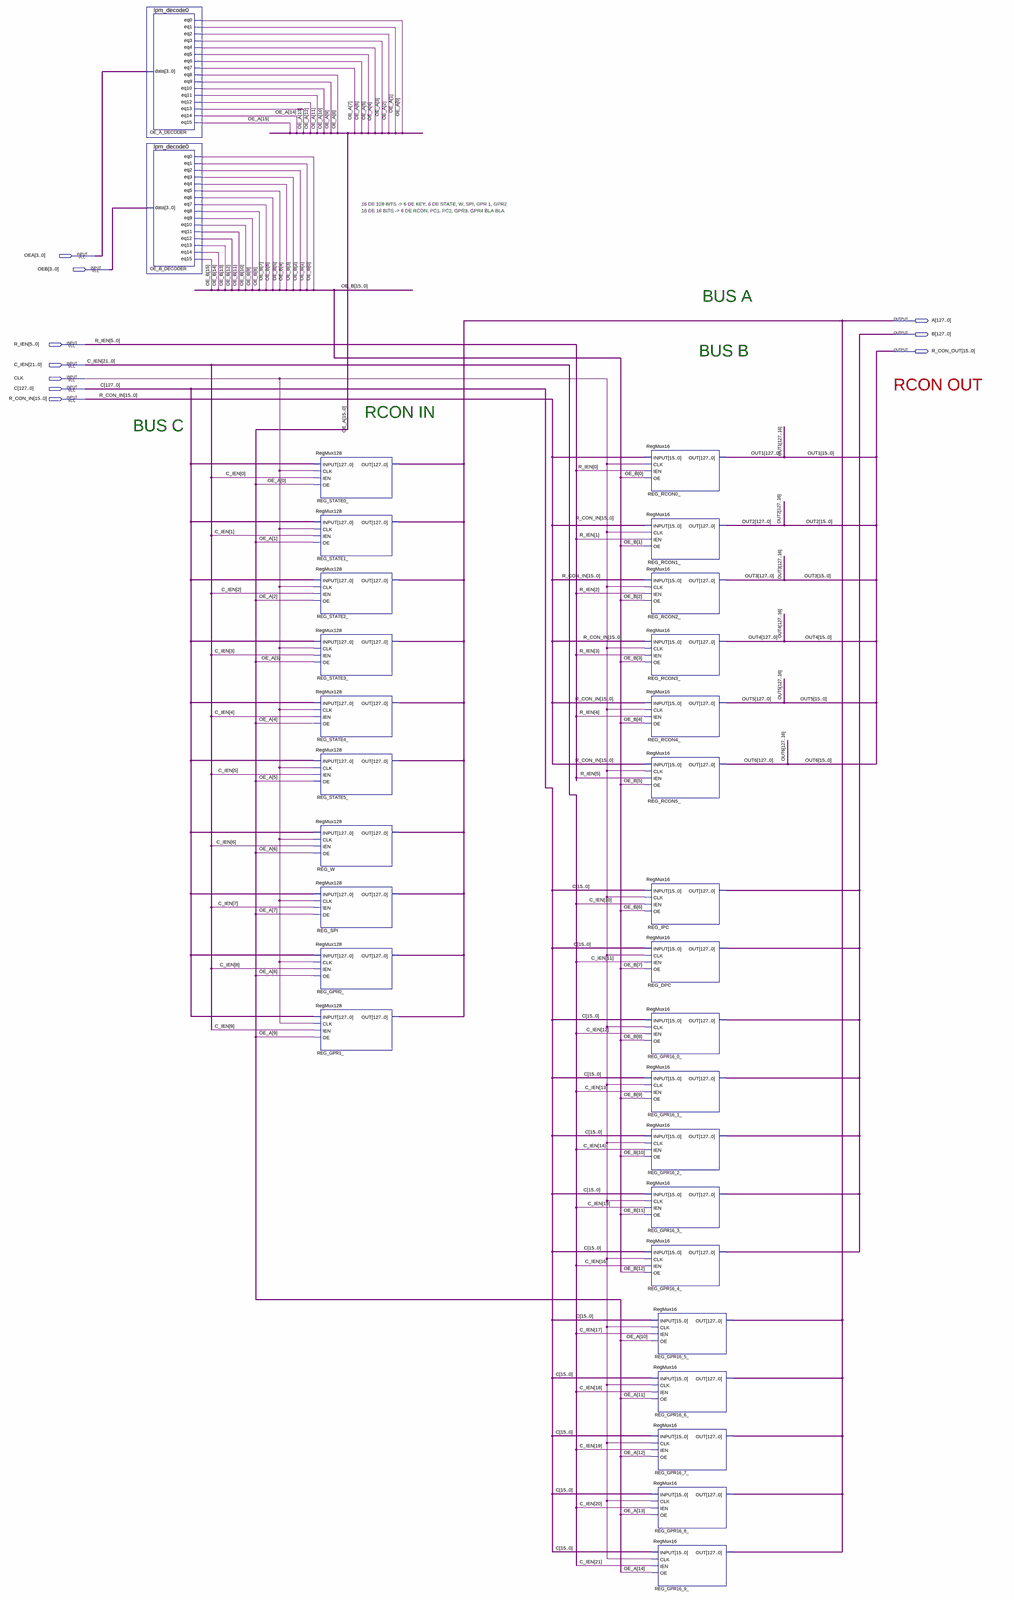
[diagram p0: schematic sheet, whole]
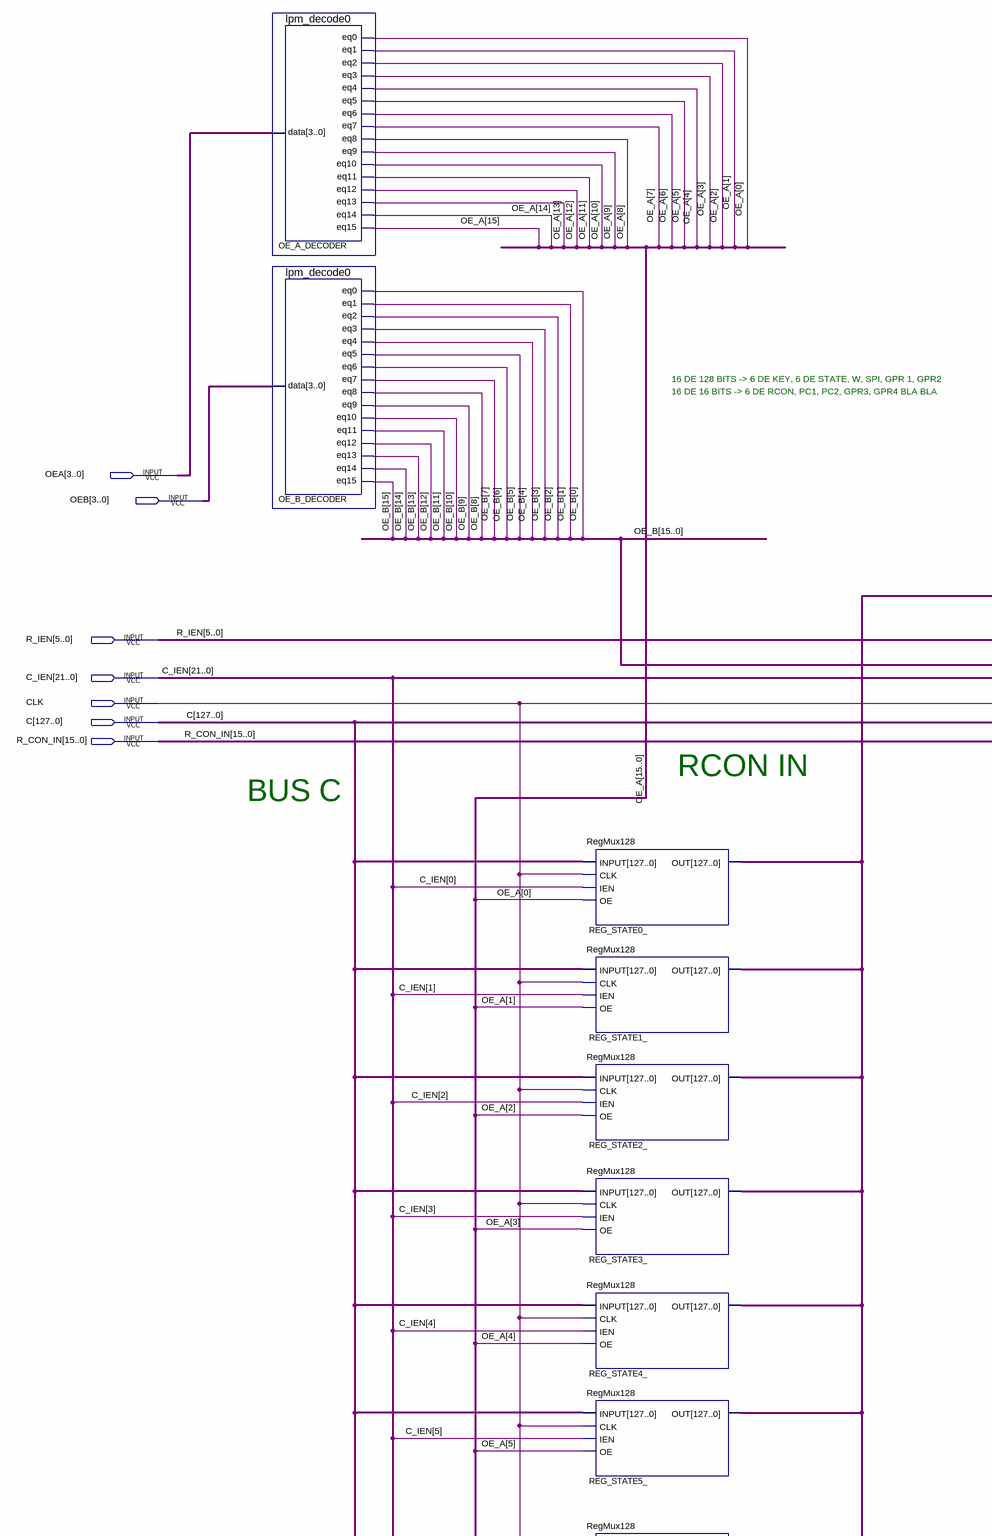
[diagram p1: schematic sheet, upper left part]
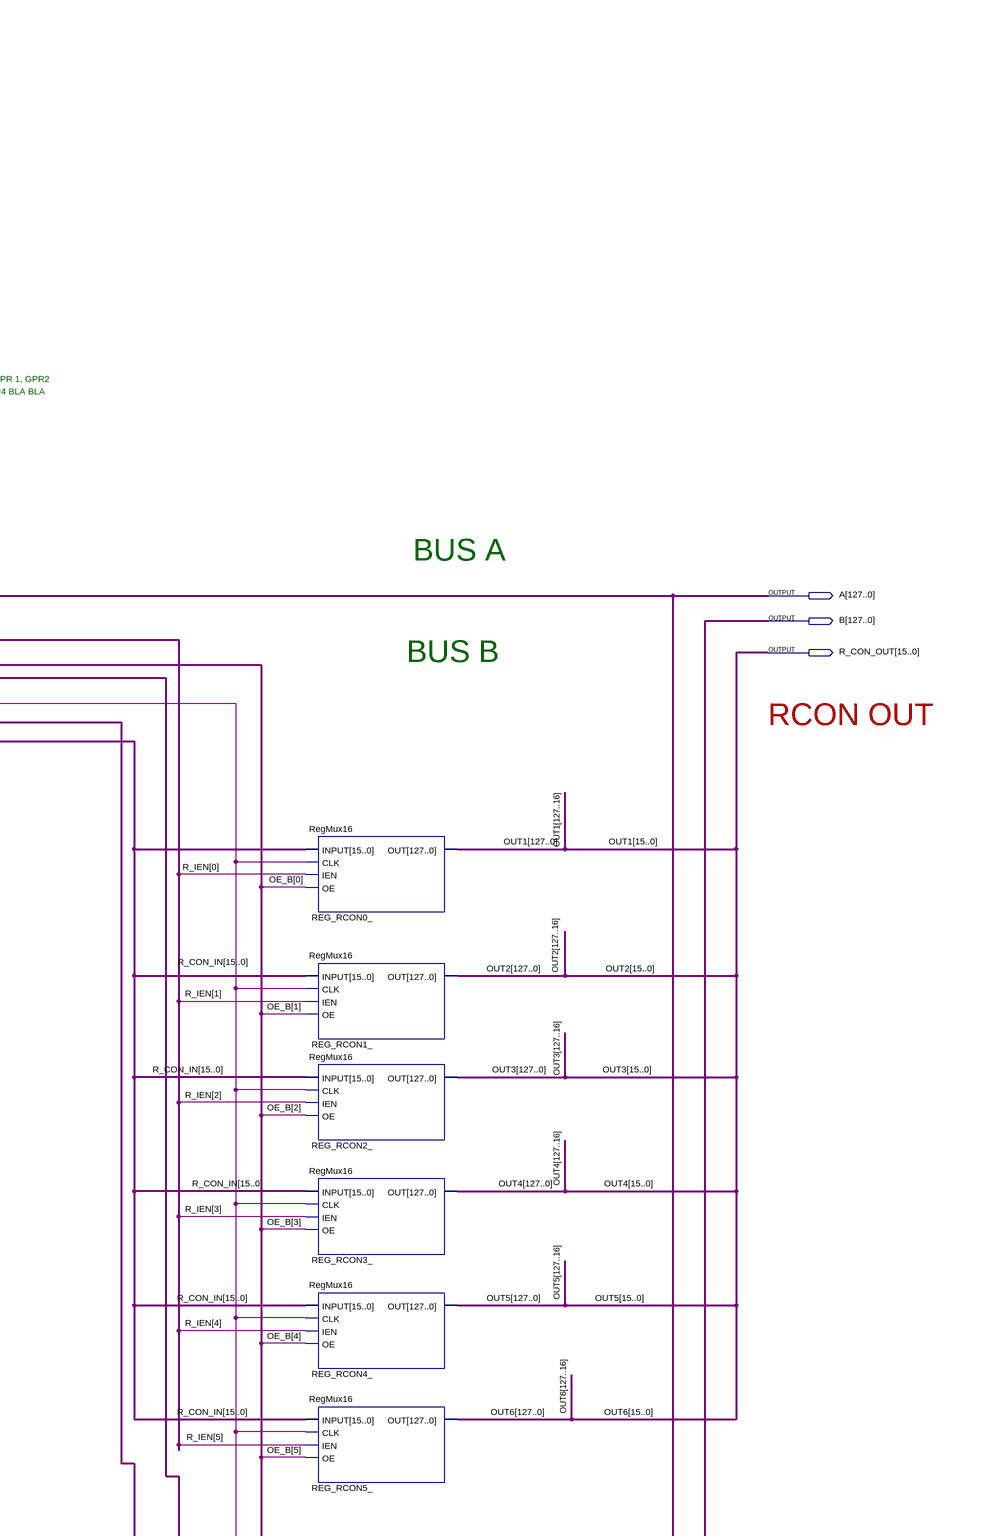
[diagram p2: schematic sheet, upper right part]
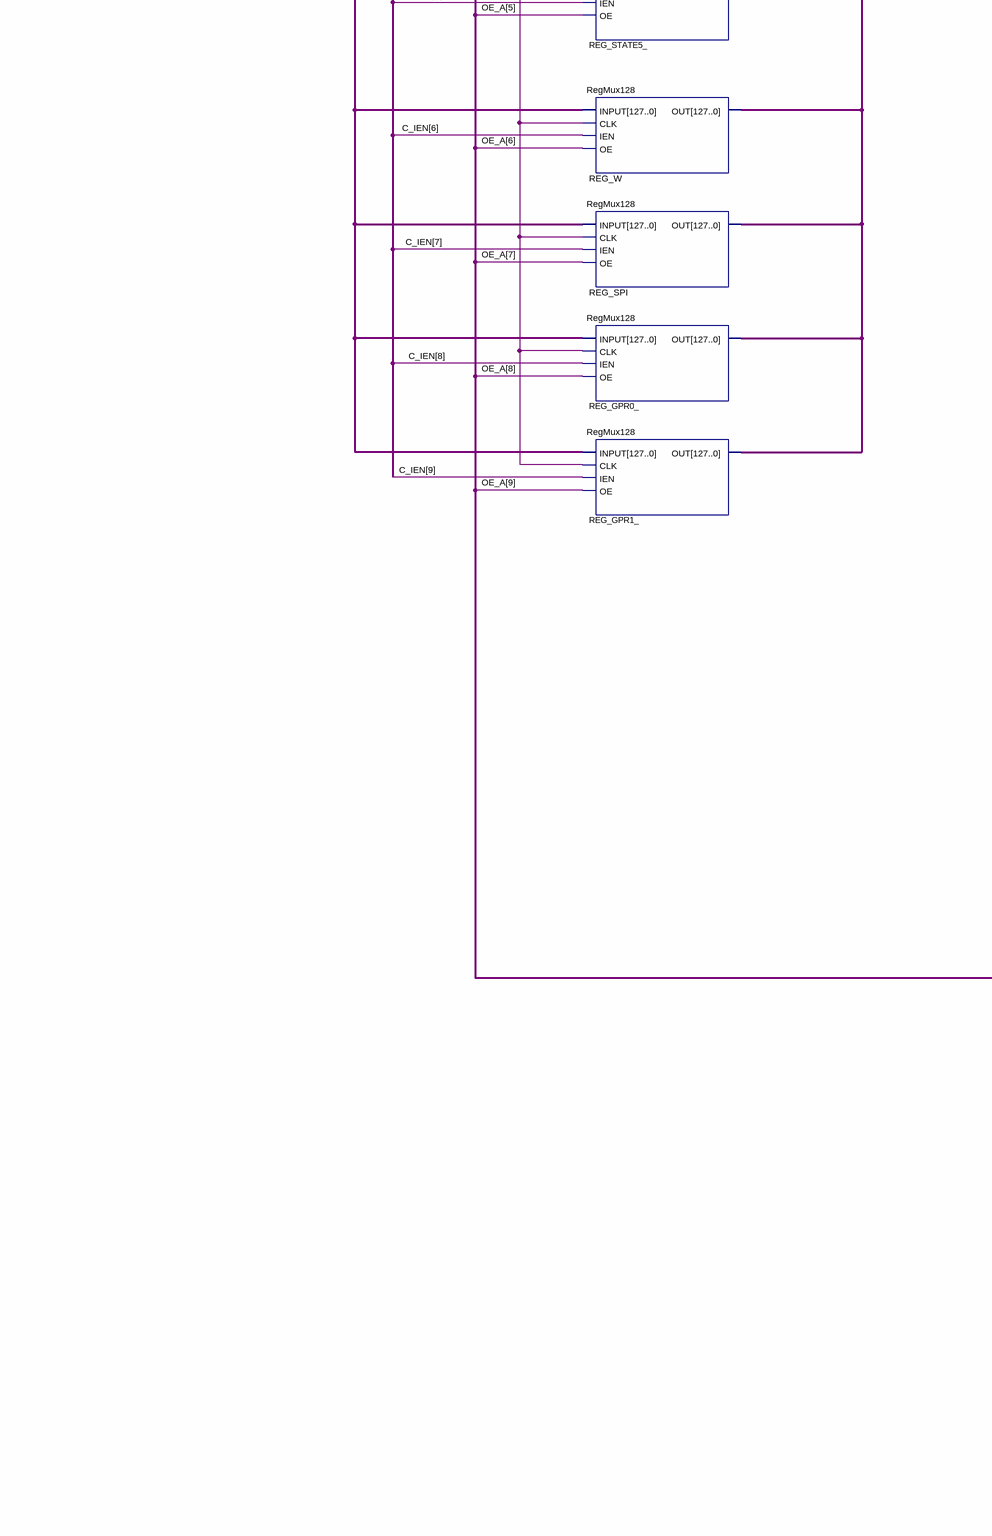
[diagram p3: schematic sheet, lower left part]
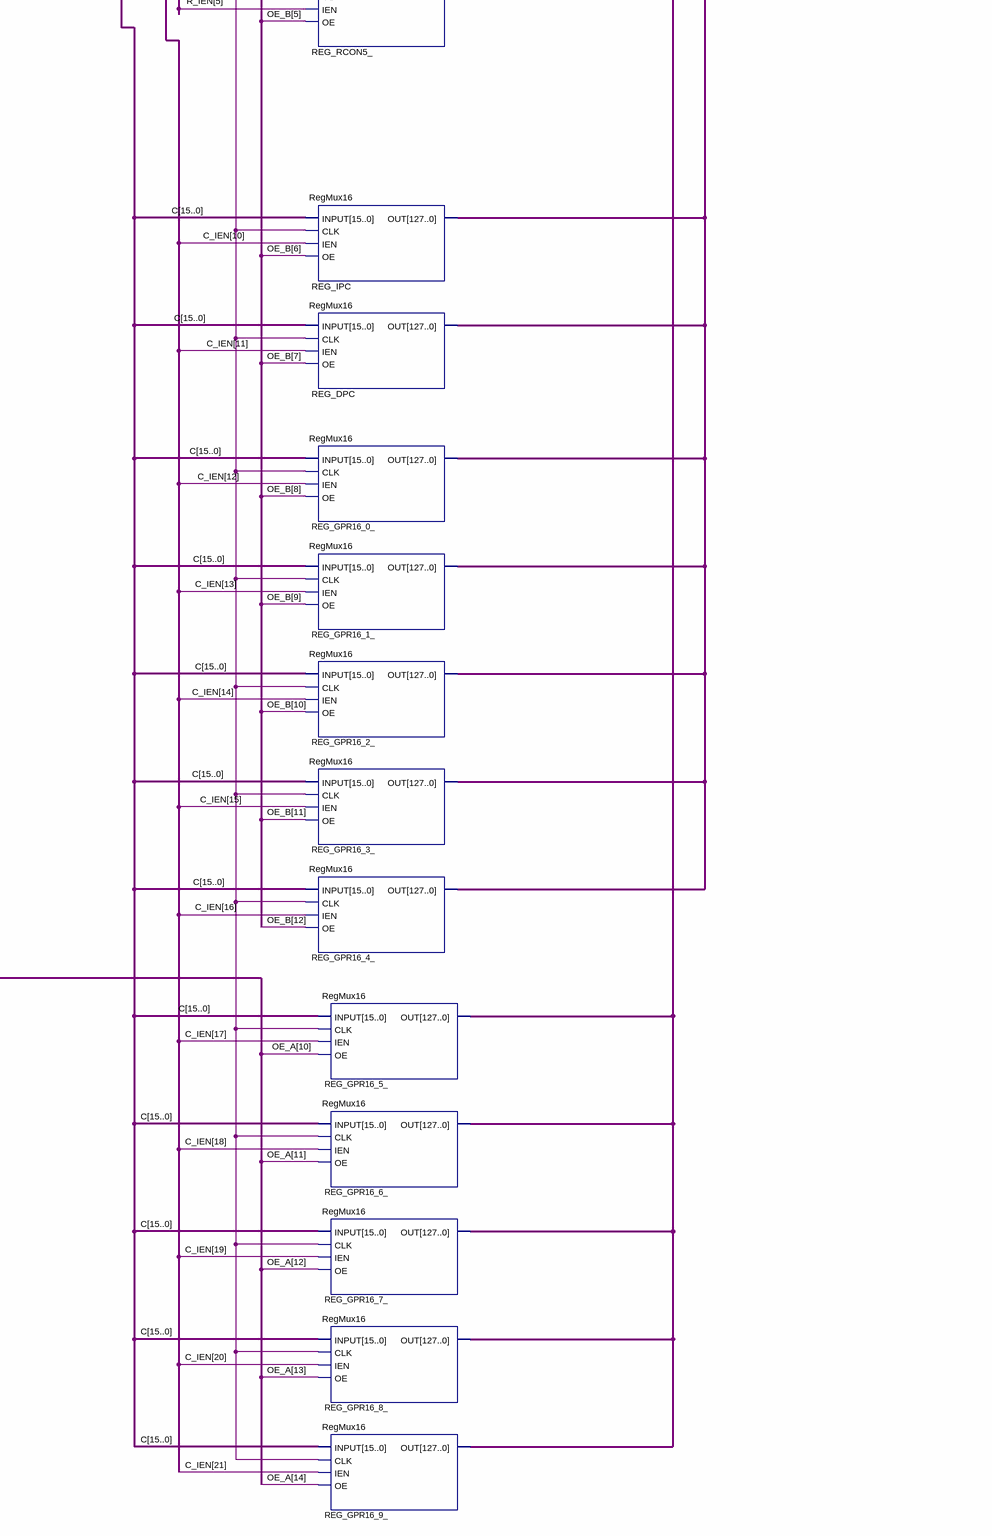
[diagram p4: schematic sheet, lower right part]
// Quartus schematic RegisterBank.bdf as structural Verilog: 30 symbols, 10 pins
module RegisterBank (
  input  [3:0] OEA,
  input  [3:0] OEB,
  input  [5:0] R_IEN,
  input  [21:0] C_IEN,
  input  CLK,
  input  [127:0] C,
  input  [15:0] R_CON_IN,
  output [127:0] A,
  output [127:0] B,
  output [15:0] R_CON_OUT
);

  wire [15:0] OE_A, OE_B;
  wire [127:0] OUT3, OUT4, OUT5, OUT6;
  wire [127:16] OUT1, OUT2;

  lpm_decode0 OE_A_DECODER (
    .data(OEA), .eq0(OE_A[0]), .eq1(OE_A[1]), .eq2(OE_A[2]), .eq3(OE_A[3]), .eq4(OE_A[4]), .eq5(OE_A[5]),
    .eq6(OE_A[6]), .eq7(OE_A[7]), .eq8(OE_A[8]), .eq9(OE_A[9]), .eq10(OE_A[10]), .eq11(OE_A[11]),
    .eq12(OE_A[12]), .eq13(OE_A[13]), .eq14(OE_A[14]), .eq15(OE_A[15]));
  lpm_decode0 OE_B_DECODER (
    .data(OEB), .eq0(OE_B[0]), .eq1(OE_B[1]), .eq2(OE_B[2]), .eq3(OE_B[3]), .eq4(OE_B[4]), .eq5(OE_B[5]),
    .eq6(OE_B[6]), .eq7(OE_B[7]), .eq8(OE_B[8]), .eq9(OE_B[9]), .eq10(OE_B[10]), .eq11(OE_B[11]),
    .eq12(OE_B[12]), .eq13(OE_B[13]), .eq14(OE_B[14]), .eq15(OE_B[15]));
  RegMux128 REG_STATE0_ (.INPUT(C), .CLK(CLK), .IEN(C_IEN[0]), .OE(OE_A[0]), .OUT(A));
  RegMux128 REG_STATE1_ (.INPUT(C), .CLK(CLK), .IEN(C_IEN[1]), .OE(OE_A[1]), .OUT(A));
  RegMux128 REG_STATE2_ (.INPUT(C), .CLK(CLK), .IEN(C_IEN[2]), .OE(OE_A[2]), .OUT(A));
  RegMux128 REG_STATE3_ (.INPUT(C), .CLK(CLK), .IEN(C_IEN[3]), .OE(OE_A[3]), .OUT(A));
  RegMux128 REG_STATE4_ (.INPUT(C), .CLK(CLK), .IEN(C_IEN[4]), .OE(OE_A[4]), .OUT(A));
  RegMux128 REG_STATE5_ (.INPUT(C), .CLK(CLK), .IEN(C_IEN[5]), .OE(OE_A[5]), .OUT(A));
  RegMux128 REG_W (.INPUT(C), .CLK(CLK), .IEN(C_IEN[6]), .OE(OE_A[6]), .OUT(A));
  RegMux128 REG_SPI (.INPUT(C), .CLK(CLK), .IEN(C_IEN[7]), .OE(OE_A[7]), .OUT(A));
  RegMux128 REG_GPR0_ (.INPUT(C), .CLK(CLK), .IEN(C_IEN[8]), .OE(OE_A[8]), .OUT(A));
  RegMux128 REG_GPR1_ (.INPUT(C), .CLK(CLK), .IEN(C_IEN[9]), .OE(OE_A[9]), .OUT(A));
  RegMux16 REG_RCON0_ (.INPUT(R_CON_IN), .CLK(CLK), .IEN(R_IEN[0]), .OE(OE_B[0]), .OUT({OUT1, R_CON_OUT}));
  RegMux16 REG_RCON1_ (.INPUT(R_CON_IN), .CLK(CLK), .IEN(R_IEN[1]), .OE(OE_B[1]), .OUT({OUT2, R_CON_OUT}));
  RegMux16 REG_RCON2_ (.INPUT(R_CON_IN), .CLK(CLK), .IEN(R_IEN[2]), .OE(OE_B[2]), .OUT(OUT3));
  RegMux16 REG_RCON3_ (.INPUT(R_CON_IN), .CLK(CLK), .IEN(R_IEN[3]), .OE(OE_B[3]), .OUT(OUT4));
  RegMux16 REG_RCON4_ (.INPUT(R_CON_IN), .CLK(CLK), .IEN(R_IEN[4]), .OE(OE_B[4]), .OUT(OUT5));
  RegMux16 REG_RCON5_ (.INPUT(R_CON_IN), .CLK(CLK), .IEN(R_IEN[5]), .OE(OE_B[5]), .OUT(OUT6));
  RegMux16 REG_IPC (.INPUT(C[15:0]), .CLK(CLK), .IEN(C_IEN[10]), .OE(OE_B[6]), .OUT(B));
  RegMux16 REG_DPC (.INPUT(C[15:0]), .CLK(CLK), .IEN(C_IEN[11]), .OE(OE_B[7]), .OUT(B));
  RegMux16 REG_GPR16_0_ (.INPUT(C[15:0]), .CLK(CLK), .IEN(C_IEN[12]), .OE(OE_B[8]), .OUT(B));
  RegMux16 REG_GPR16_1_ (.INPUT(C[15:0]), .CLK(CLK), .IEN(C_IEN[13]), .OE(OE_B[9]), .OUT(B));
  RegMux16 REG_GPR16_2_ (.INPUT(C[15:0]), .CLK(CLK), .IEN(C_IEN[14]), .OE(OE_B[10]), .OUT(B));
  RegMux16 REG_GPR16_3_ (.INPUT(C[15:0]), .CLK(CLK), .IEN(C_IEN[15]), .OE(OE_B[11]), .OUT(B));
  RegMux16 REG_GPR16_4_ (.INPUT(C[15:0]), .CLK(CLK), .IEN(C_IEN[16]), .OE(OE_B[12]), .OUT(B));
  RegMux16 REG_GPR16_5_ (.INPUT(C[15:0]), .CLK(CLK), .IEN(C_IEN[17]), .OE(OE_A[10]), .OUT(A));
  RegMux16 REG_GPR16_6_ (.INPUT(C[15:0]), .CLK(CLK), .IEN(C_IEN[18]), .OE(OE_A[11]), .OUT(A));
  RegMux16 REG_GPR16_7_ (.INPUT(C[15:0]), .CLK(CLK), .IEN(C_IEN[19]), .OE(OE_A[12]), .OUT(A));
  RegMux16 REG_GPR16_8_ (.INPUT(C[15:0]), .CLK(CLK), .IEN(C_IEN[20]), .OE(OE_A[13]), .OUT(A));
  RegMux16 REG_GPR16_9_ (.INPUT(C[15:0]), .CLK(CLK), .IEN(C_IEN[21]), .OE(OE_A[14]), .OUT(A));

  // Other names for the same wires on the sheet: OUT1[15:0] = R_CON_OUT; OUT2[15:0] = R_CON_OUT

  // Notes on the sheet:
  //   16 DE 128 BITS -> 6 DE KEY, 6 DE STATE, W, SPI, GPR 1, GPR2             
  //   16 DE 16 BITS -> 6 DE RCON, PC1, PC2, GPR3, GPR4 BLA BLA
  //   BUS A  
  //   BUS B  
  //   RCON OUT  
  //   RCON IN   
  //   BUS C  
endmodule
